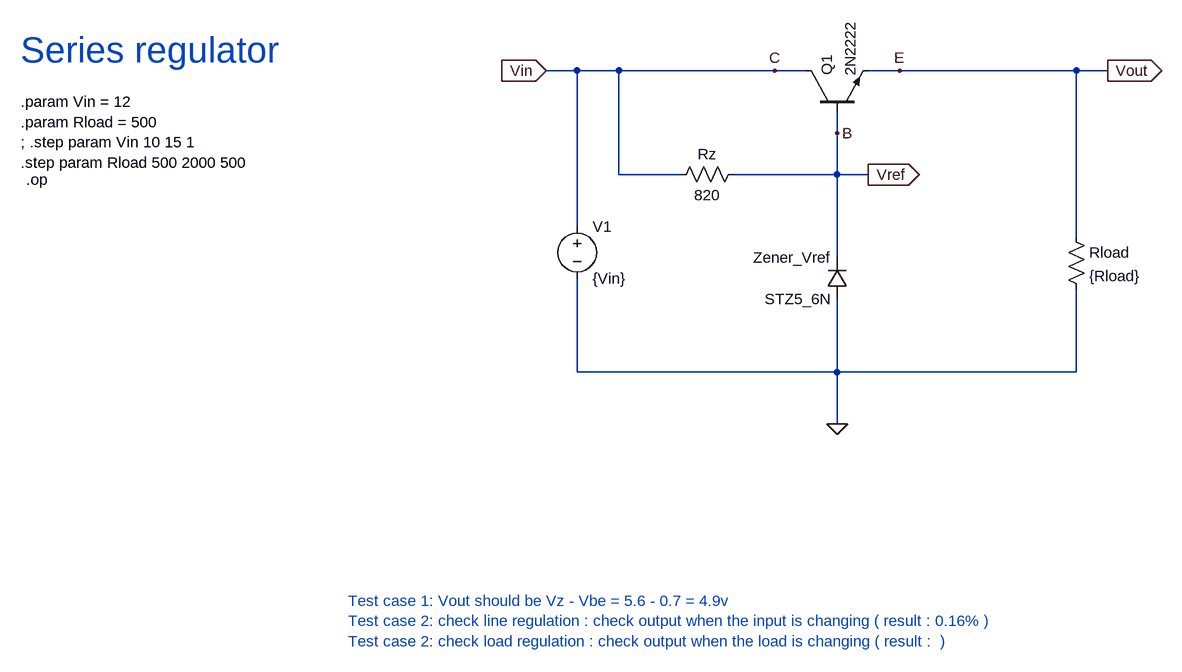
[diagram p0: schematic Series_regulator.asc]
Series_regulator.asc, the LTspice schematic file:
Version 4.1
SHEET 1 1056 1012
WIRE -1696 -352 -1744 -352
WIRE -1632 -352 -1696 -352
WIRE -1392 -352 -1632 -352
WIRE -1344 -352 -1392 -352
WIRE -1200 -352 -1248 -352
WIRE -928 -352 -1200 -352
WIRE -880 -352 -928 -352
WIRE -1296 -256 -1296 -288
WIRE -1632 -192 -1632 -352
WIRE -1536 -192 -1632 -192
WIRE -1296 -192 -1296 -256
WIRE -1296 -192 -1456 -192
WIRE -1248 -192 -1296 -192
WIRE -1696 -112 -1696 -352
WIRE -928 -96 -928 -352
WIRE -1296 -64 -1296 -192
WIRE -1696 112 -1696 -32
WIRE -1296 112 -1296 0
WIRE -1296 112 -1696 112
WIRE -928 112 -928 -16
WIRE -928 112 -1296 112
WIRE -1296 192 -1296 112
FLAG -1296 192 0
FLAG -1392 -352 C
FLAG -1200 -352 E
FLAG -1296 -256 B
FLAG -1744 -352 Vin
IOPIN -1744 -352 In
FLAG -880 -352 Vout
IOPIN -880 -352 Out
FLAG -1248 -192 Vref
IOPIN -1248 -192 Out
SYMBOL npn2 -1344 -288 R270
SYMATTR InstName Q1
SYMATTR Value 2N2222
SYMBOL voltage -1696 -128 R0
WINDOW 123 0 0 Left 0
WINDOW 39 0 0 Left 0
SYMATTR InstName V1
SYMATTR Value {Vin}
SYMBOL diode -1280 0 R180
WINDOW 0 24 64 Left 2
WINDOW 3 24 0 Left 2
SYMATTR InstName Zener_Vref
SYMATTR Value STZ5_6N
SYMBOL res -1440 -208 R90
WINDOW 0 0 56 VBottom 2
WINDOW 3 32 56 VTop 2
SYMATTR InstName Rz
SYMATTR Value 820
SYMBOL res -944 -112 R0
SYMATTR InstName Rload
SYMATTR Value {Rload}
TEXT -2552 -384 Left 5 ;Series regulator
TEXT -2552 -304 Left 2 !.param Vin = 12\n.param Rload = 500\n; .step param Vin 10 15 1\n.step param Rload 500 2000 500
TEXT -2544 -184 Left 2 !.op
TEXT -2048 464 Left 2 ;Test case 1: Vout should be Vz - Vbe = 5.6 - 0.7 = 4.9v\nTest case 2: check line regulation : check output when the input is changing ( result : 0.16% )\nTest case 2: check load regulation : check output when the load is changing ( result :  )

The netlist it stands for:
* Series_regulator.asc
Q1 Vin Vref Vout 0 2N2222
V1 Vin 0 {Vin}
D§Zener_Vref 0 Vref STZ5_6N
Rz Vref Vin 820
Rload Vout 0 {Rload}
.model D D
.lib standard.dio
.model NPN NPN
.model PNP PNP
.lib standard.bjt
* Series regulator
.param Vin = 12
.param Rload = 500
; .step param Vin 10 15 1
.step param Rload 500 2000 500
.op
* Test case 1: Vout should be Vz - Vbe = 5.6 - 0.7 = 4.9v
* Test case 2: check line regulation : check output when the input is changing ( result : 0.16% )
* Test case 2: check load regulation : check output when the load is changing ( result :  )
.backanno
.end